# EAGLE design BLDC_Motor_Controller_IR2184 (EAGLE 9.1.3)
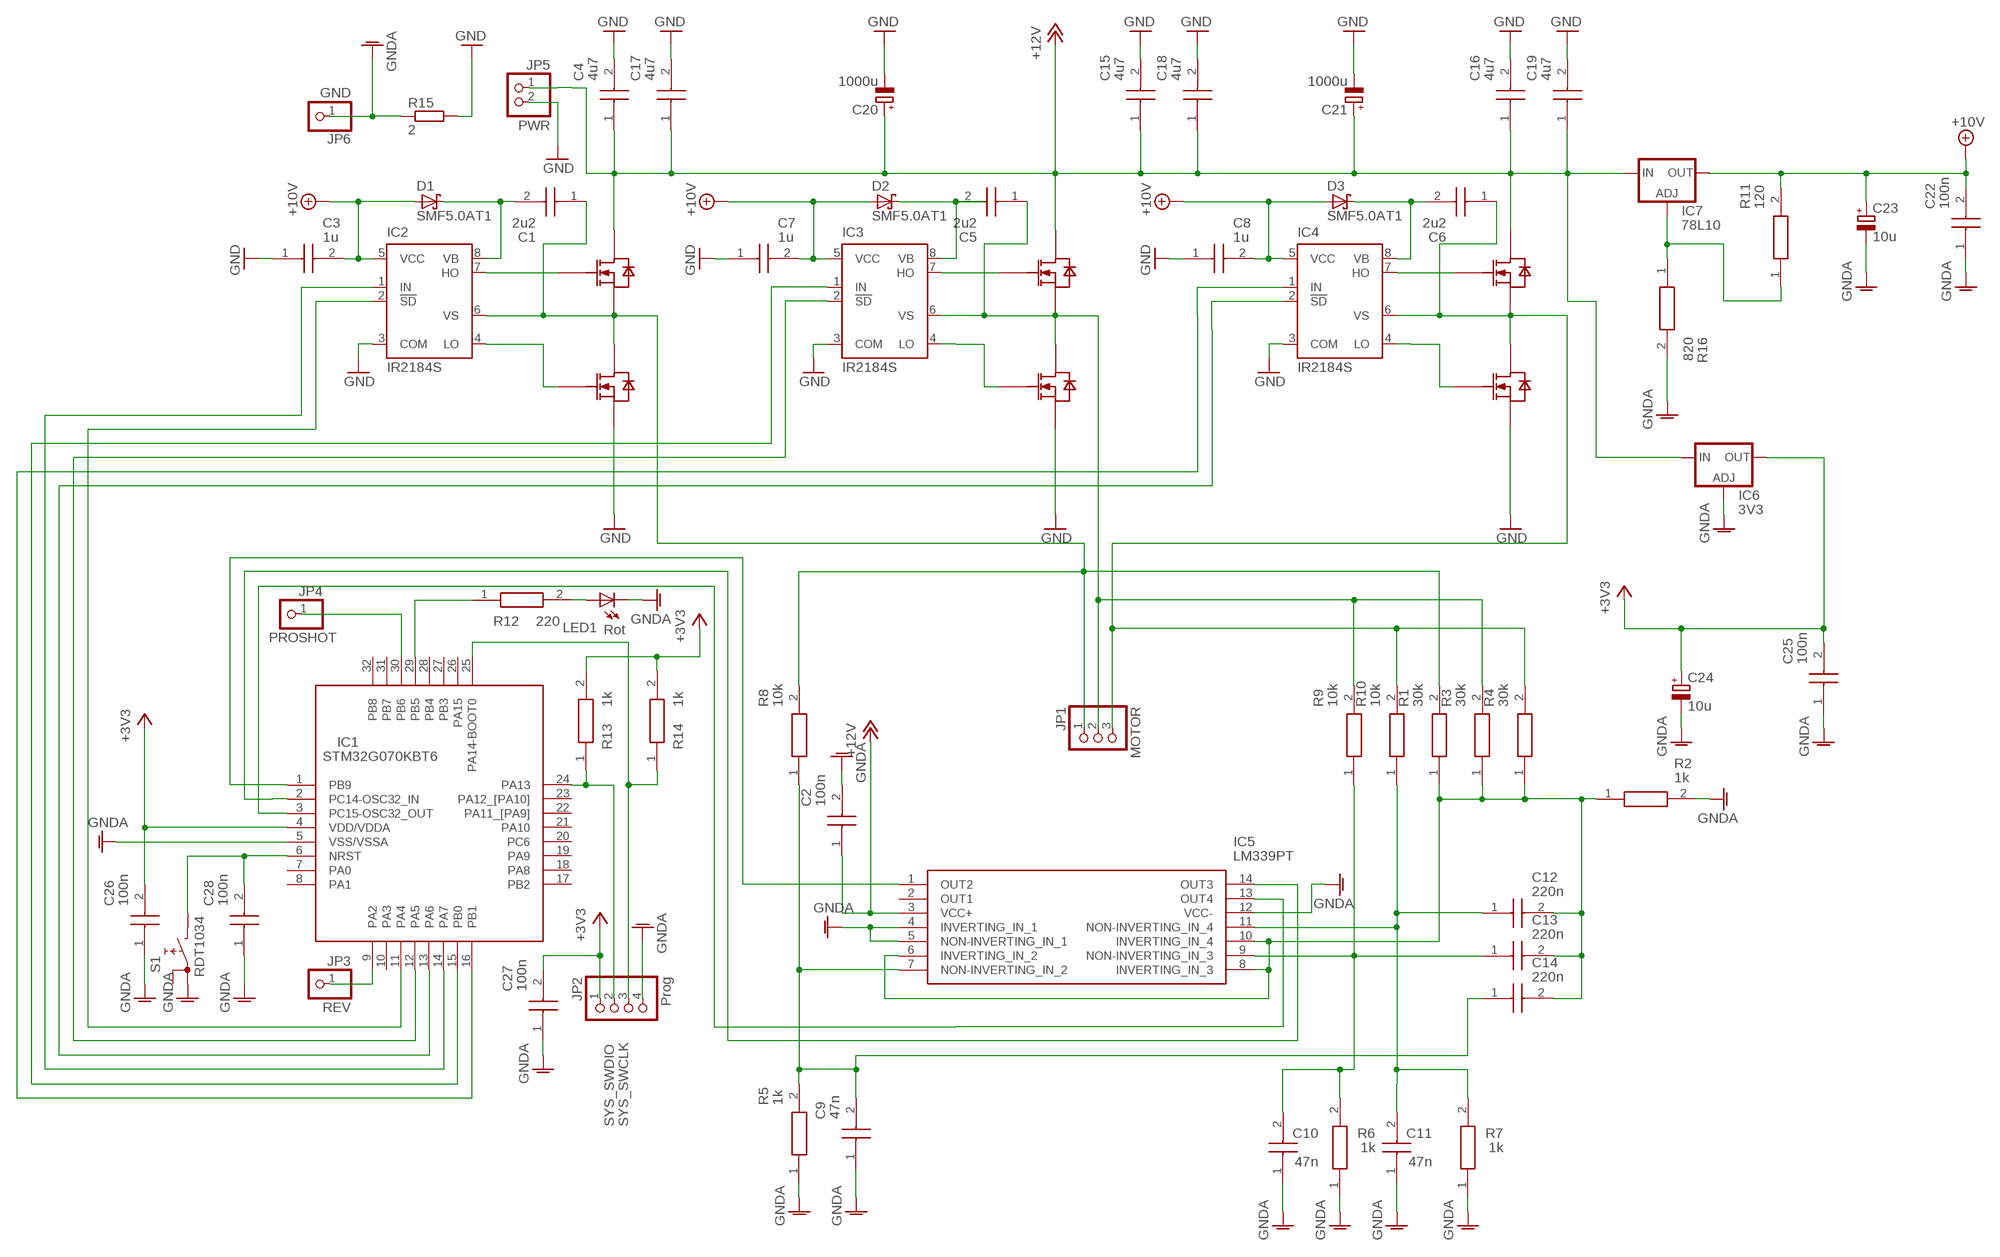
[diagram p0: schematic, sheet 1]

## Parts
C1  2u2  CL21B225KAFNNNE  [CAPC2012X135N]
C2  100n  C2012X7T2E104M125AE  [CAPC2012X145N]
C3  1u  GRM31CC72A475KE11K  [GRM31X]
C4  4u7  GRM31CC72A475KE11K  [GRM31X]
C5  2u2  CL21B225KAFNNNE  [CAPC2012X135N]
C6  2u2  CL21B225KAFNNNE  [CAPC2012X135N]
C7  1u  GRM31CC72A475KE11K  [GRM31X]
C8  1u  GRM31CC72A475KE11K  [GRM31X]
C9  47n  C2012X7T2E104M125AE  [CAPC2012X145N]
C10  47n  C2012X7T2E104M125AE  [CAPC2012X145N]
C11  47n  C2012X7T2E104M125AE  [CAPC2012X145N]
C12  220n  C2012X7T2E104M125AE  [CAPC2012X145N]
C13  220n  C2012X7T2E104M125AE  [CAPC2012X145N]
C14  220n  C2012X7T2E104M125AE  [CAPC2012X145N]
C15  4u7  GRM31CC72A475KE11K  [GRM31X]
C16  4u7  GRM31CC72A475KE11K  [GRM31X]
C17  4u7  GRM31CC72A475KE11K  [GRM31X]
C18  4u7  GRM31CC72A475KE11K  [GRM31X]
C19  4u7  GRM31CC72A475KE11K  [GRM31X]
C20  1000u  CPOL-EU150CLZ-0810  [150CLZ-0810]
C21  1000u  CPOL-EU150CLZ-0810  [150CLZ-0810]
C22  100n  C2012X7T2E104M125AE  [CAPC2012X145N]
C23  10u  CPOL-EUSMCC  [SMC_C]
C24  10u  CPOL-EUSMCC  [SMC_C]
C25  100n  C2012X7T2E104M125AE  [CAPC2012X145N]
C26  100n  C2012X7T2E104M125AE  [CAPC2012X145N]
C27  100n  C2012X7T2E104M125AE  [CAPC2012X145N]
C28  100n  C2012X7T2E104M125AE  [CAPC2012X145N]
D1  SMF5.0AT1  [SOD123FL]
D2  SMF5.0AT1  [SOD123FL]
D3  SMF5.0AT1  [SOD123FL]
IC1  STM32G070KBT6  [QFP80P900X900X160-32N]
IC2  IR2184S  [SO08]
IC3  IR2184S  [SO08]
IC4  IR2184S  [SO08]
IC5  LM339PT  [SOP65P640X120-14N]
IC6  3V3  LD117AS33TR  [SOT223]
IC7  78L10  LD117ASTR  [SOT223]
JP1  MOTOR  PINHD-1X3  [1X03]
JP2  Prog  PINHD-1X4  [1X04]
JP3  REV  PINHD-1X1  [1X01]
JP4  PROSHOT  PINHD-1X1  [1X01]
JP5  PWR  PINHD-1X2  [1X02]
JP6  GND  PINHD-1X1  [1X01]
LED1  Rot  LEDSML0805  [SML0805]
Q1  IRFR1205TRPBF  [TO229P991X239-3_4N]
Q2  IRFR1205TRPBF  [TO229P991X239-3_4N]
Q3  IRFR1205TRPBF  [TO229P991X239-3_4N]
Q4  IRFR1205TRPBF  [TO229P991X239-3_4N]
Q5  IRFR1205TRPBF  [TO229P991X239-3_4N]
Q6  IRFR1205TRPBF  [TO229P991X239-3_4N]
R1  30k  ERJ-UP6F1180V  [ERJUP6]
R2  1k  ERJ-UP6F1180V  [ERJUP6]
R3  30k  ERJ-UP6F1180V  [ERJUP6]
R4  30k  ERJ-UP6F1180V  [ERJUP6]
R5  1k  ERJ-UP6F1180V  [ERJUP6]
R6  1k  ERJ-UP6F1180V  [ERJUP6]
R7  1k  ERJ-UP6F1180V  [ERJUP6]
R8  10k  ERJ-UP6F1180V  [ERJUP6]
R9  10k  ERJ-UP6F1180V  [ERJUP6]
R10  10k  ERJ-UP6F1180V  [ERJUP6]
R11  120  ERJ-UP6F1180V  [ERJUP6]
R12  220  ERJ-UP6F1180V  [ERJUP6]
R13  1k  ERJ-UP6F1180V  [ERJUP6]
R14  1k  ERJ-UP6F1180V  [ERJUP6]
R15  2  R-EU_R2012  [R2012]
R16  820  ERJ-UP6F1180V  [ERJUP6]
S1  RDT1034  [RDT1034]

## Nets
+3V3: C24.+ C25.2 C26.2 C27.2 IC1.4(VDD/VDDA) IC6.4(OUT) JP2.1 R13.2 R14.2
+10V: C3.2 C7.2 C8.2 C22.2 C23.+ D1.A D2.A D3.A IC2.5(VCC) IC3.5(VCC) IC4.5(VCC) IC7.4(OUT) R11.2
+12V: C2.1 C4.1 C15.1 C16.1 C17.1 C18.1 C19.1 C20.+ C21.+ IC5.3(VCC+) IC6.3(IN) IC7.3(IN) JP5.1 Q1.4(DRAIN) Q3.4(DRAIN) Q5.4(DRAIN)
BEMF_U: C9.2 C14.1 IC5.7(NON-INVERTING_IN_2) R5.2 R8.1
BEMF_V: C10.2 C13.1 IC5.9(NON-INVERTING_IN_3) R6.2 R9.1
BEMFGND: C12.2 C13.2 C14.2 IC5.6(INVERTING_IN_2) IC5.8(INVERTING_IN_3) IC5.10(INVERTING_IN_4) R1.1 R2.1 R3.1 R4.1
BEMV_W: C11.2 C12.1 IC5.11(NON-INVERTING_IN_4) R7.2 R10.1
GND: C3.1 C4.2 C7.1 C8.1 C15.2 C16.2 C17.2 C18.2 C19.2 C20.- C21.- IC2.3(COM) IC3.3(COM) IC4.3(COM) JP5.2 Q2.3(SOURCE) Q4.3(SOURCE) Q6.3(SOURCE) R15.2
GNDA: C2.2 C9.1 C10.1 C11.1 C22.1 C23.- C24.- C25.1 C26.1 C27.1 C28.1 IC1.5(VSS/VSSA) IC5.4(INVERTING_IN_1) IC5.5(NON-INVERTING_IN_1) IC5.12(VCC-) IC6.1(ADJ) JP2.4 JP6.1 LED1.C R2.2 R5.1 R6.1 R7.1 R15.1 R16.2 S1.A1
IN_U: IC1.14(PA7) IC2.1(IN)
IN_V: IC1.15(PB0) IC3.1(IN)
IN_W: IC1.16(PB1) IC4.1(IN)
INT_U: IC1.1(PB9) IC5.1(OUT2)
INT_V: IC1.2(PC14-OSC32_IN) IC5.14(OUT3)
INT_W: IC1.3(PC15-OSC32_OUT) IC5.13(OUT4)
N$1: C5.2 D2.C IC3.8(VB)
N$2: IC3.7(HO) Q3.1(GATE)
N$3: LED1.A R12.2
N$4: IC4.7(HO) Q5.1(GATE)
N$5: C6.2 D3.C IC4.8(VB)
N$6: IC3.4(LO) Q4.1(GATE)
N$7: IC2.7(HO) Q1.1(GATE)
N$8: IC2.4(LO) Q2.1(GATE)
N$9: IC7.1(ADJ) R11.1 R16.1
N$10: IC4.4(LO) Q6.1(GATE)
N$11: C1.2 D1.C IC2.8(VB)
N$14: IC1.29(PB5) R12.1
N$18: IC1.9(PA2) JP3.1
N$26: C28.2 IC1.6(NRST) S1.B
N$31: IC1.30(PB6) JP4.1
SD_U: IC1.11(PA4) IC2.2(!SD)
SD_V: IC1.12(PA5) IC3.2(!SD)
SD_W: IC1.13(PA6) IC4.2(!SD)
SYS_SWCLK: IC1.25(PA14-BOOT0) JP2.3 R14.1
SYS_SWDIO: IC1.24(PA13) JP2.2 R13.1
U: C1.1 IC2.6(VS) JP1.1 Q1.3(SOURCE) Q2.4(DRAIN) R1.2 R8.2
V: C5.1 IC3.6(VS) JP1.2 Q3.3(SOURCE) Q4.4(DRAIN) R3.2 R9.2
W: C6.1 IC4.6(VS) JP1.3 Q5.3(SOURCE) Q6.4(DRAIN) R4.2 R10.2
Unconnected: IC1.7(PA0) IC1.8(PA1) IC1.10(PA3) IC1.17(PB2) IC1.18(PA8) IC1.19(PA9) IC1.20(PC6) IC1.21(PA10) IC1.22(PA11_[PA9]) IC1.23(PA12_[PA10]) IC1.26(PA15) IC1.27(PB3) IC1.28(PB4) IC1.31(PB7) IC1.32(PB8) IC5.2(OUT1) S1.A

## Library data of the parts
C1 C5 C6 = SamacSys_Parts:CL21B225KAFNNNE: Multilayer Ceramic Capacitors MLCC - SMD/SMT Source: Datasheet <https://datasheet.datasheetarchive.com/originals/distributors/Datasheets_SAMA/ca4cf5b380bdfbb19a7117d5cd03bc0d.pdf>; DESCRIPTION: Multilayer Ceramic Capacitors MLCC - SMD/SMT; HEIGHT: 1.35mm; MANUFACTURER_NAME: SAMSUNG; MANUFACTURER_PART_NUMBER: CL21B225KAFNNNE; MOUSER_PART_NUMBER: 187-CL21B225KAFNNNE; MOUSER_PRICE-STOCK: https://www.mouser.co.uk/ProductDetail/Samsung-Electro-Mechanics/CL21B225KAFNNNE?qs=PPfjzIQ%252BipRYUTZ31NBO%252Bg%3D%3D
C2 C9-C14 C22 C25-C28 = SamacSys_Parts:C2012X7T2E104M125AE: TDK 0805 C 100nF Ceramic Multilayer Capacitor, 250 V dc, +125C, X7T Dielectric, +/-20% Source: Datasheet <https://product.tdk.com/info/en/catalog/datasheets/mlcc_commercial_midvoltage_en.pdf>; DESCRIPTION: TDK 0805 C 100nF Ceramic Multilayer Capacitor, 250 V dc, +125C, X7T Dielectric, +/-20%; HEIGHT: 1.45mm; MANUFACTURER_NAME: TDK; MANUFACTURER_PART_NUMBER: C2012X7T2E104M125AE; MOUSER_PART_NUMBER: 810-C2012X7T2E104MST; MOUSER_PRICE-STOCK: https://www.mouser.co.uk/ProductDetail/TDK/C2012X7T2E104M125AE?qs=LcTL%2F5vFEzEBl%252BBNoexy6w%3D%3D
C3 C7 C8 = SamacSys_Parts:GRM31CC72A475KE11K: MLCC, 1206 Source: Datasheet <https://search.murata.co.jp/Ceramy/image/img/A01X/G101/ENG/GRM31CC72A475KE11-01A.pdf>; DESCRIPTION: MLCC, 1206; HEIGHT: 1.15mm; MANUFACTURER_NAME: Murata Electronics; MANUFACTURER_PART_NUMBER: GRM31CC72A475KE11K; MOUSER_PART_NUMBER: 81-GRM31CC72A475KE1K; MOUSER_PRICE-STOCK: https://www.mouser.co.uk/ProductDetail/Murata-Electronics/GRM31CC72A475KE11K?qs=d0WKAl%252BL4KaOKvbzjRPpKw%3D%3D
C4 C15-C19 = GRM31CC72A475KE11K:GRM31CC72A475KE11K: MLCC, 1206 Source: Datasheet <https://search.murata.co.jp/Ceramy/image/img/A01X/G101/ENG/GRM31CC72A475KE11-01A.pdf>; DESCRIPTION: MLCC, 1206; HEIGHT: 1.15mm; MANUFACTURER_NAME: Murata Electronics; MANUFACTURER_PART_NUMBER: GRM31CC72A475KE11K; MOUSER_PART_NUMBER: 81-GRM31CC72A475KE1K; MOUSER_PRICE-STOCK: https://www.mouser.co.uk/ProductDetail/Murata-Electronics/GRM31CC72A475KE11K?qs=d0WKAl%252BL4KaOKvbzjRPpKw%3D%3D
C20 C21 C23 C24 = rcl:CPOL-EU: POLARIZED CAPACITOR, European symbol; SPICEPREFIX: C
D1-D3 = diode:SMF5.0AT1: 200 W Transient Voltage Suppressor Source: Data sheet <http://www.onsemi.com/pub_link/Collateral/SMF5.0AT1-D.PDF>
IC1 = SamacSys_Parts:STM32G070KBT6: 32-bit Microcontrollers - MCU Arm Cortex -M0+ 32-bit MCU, 128 KB Flash, 36 KB RAM, 4x USART, timers, ADC, comm. I/Fs, 2.0-3.6V Source: Datasheet; DESCRIPTION: 32-bit Microcontrollers - MCU Arm Cortex -M0+ 32-bit MCU, 128 KB Flash, 36 KB RAM, 4x USART, timers, ADC, comm. I/Fs, 2.0-3.6V; HEIGHT: 1.6mm; MANUFACTURER_NAME: STMicroelectronics; MANUFACTURER_PART_NUMBER: STM32G070KBT6; MOUSER_PART_NUMBER: 511-STM32G070KBT6; MOUSER_PRICE-STOCK: https://www.mouser.co.uk/ProductDetail/STMicroelectronics/STM32G070KBT6?qs=l7cgNqFNU1hmGcXjKEot4A%3D%3D
IC2-IC4 = IR2184:IR2184: HALF-BRIDGE DRIVER www.irf.com Data Sheet No. PD60174 revG Features *Floating channel designed for bootstrap operation Fully operational to +600V *Tolerant to negative transient voltage dV/dt immune * Gate drive supply range from 10 to 20V * Undervoltage lockout for both channels * 3.3V and 5V input logic compatible * Matched propagation delay for both channels * Logic and power ground +/- 5V offset. * Lower di/dt gate driver for better noise immunity * Output source/sink current capability 1.4A/1.8A * Also available LEAD-FREE (PbF); MF: INTERNATIONAL RECTIFIER(IR); MPN: IR2184
IC5 = SamacSys_Parts:LM339PT: LM339PT,Voltage comparator,quad,TSSOP14 STMicroelectronics LM339PT Quad Comparator, CMOS/TTL O/P, 1.3us 2 36 V 14-Pin TSSOP Source: Datasheet <http://www.st.com/web/en/resource/technical/document/datasheet/CD00000460.pdf>; DESCRIPTION: LM339PT,Voltage comparator,quad,TSSOP14 STMicroelectronics LM339PT Quad Comparator, CMOS/TTL O/P, 1.3us 2 36 V 14-Pin TSSOP; HEIGHT: 1.2mm; MANUFACTURER_NAME: STMicroelectronics; MANUFACTURER_PART_NUMBER: LM339PT; MOUSER_PART_NUMBER: 511-LM339P; MOUSER_PRICE-STOCK: https://www.mouser.co.uk/ProductDetail/STMicroelectronics/LM339PT?qs=qY7WzS0PiaebXCzOp7NP%2FA%3D%3D
IC6 IC7 = v-reg:LD117A?*: Low drop fixed and adjustable positive voltage regulators 1 A Source: http://www.st.com/stonline/products/literature/ds/7194/ld1117axx.pdf
JP1 = pinhead:PINHD-1X3: PIN HEADER
JP2 = pinhead:PINHD-1X4: PIN HEADER
JP3 JP4 JP6 = pinhead:PINHD-1X1: PIN HEADER
JP5 = pinhead:PINHD-1X2: PIN HEADER
LED1 = led:LED: LED OSRAM: - CHIPLED LG R971, LG N971, LY N971, LG Q971, LY Q971, LO R971, LY R971 LH N974, LH R974 LS Q976, LO Q976, LY Q976 LO Q996 - Hyper CHIPLED LW Q18S LB Q993, LB Q99A, LB R99A - SideLED LS A670, LO A670, LY A670, LG A670, LP A670 LB A673, LV A673, LT A673, LW A673 LH A674 LY A675 LS A676, LA A676, LO A676, LY A676, LW A676 LS A679, LY A679, LG A679 - Hyper Micro SIDELED® LS Y876, LA Y876, LO Y876, LY Y876 LT Y87S - SmartLED LW L88C, LW L88S LB L89C, LB L89S, LG L890 LS L89K, LO L89K, LY L89K LS L896, LA L896, LO L896, LY L896 - TOPLED LS T670, LO T670, LY T670, LG T670, LP T670 LSG T670, LSP T670, LSY T670, LOP T670, LYG T670 LG T671, LOG T671, LSG T671 LB T673, LV T673, LT T673, LW T673 LH T674 LS T676, LA T676, LO T676, LY T676, LB T676, LH T676, LSB T676, LW T676 LB T67C, LV T67C, LT T67C, LS T67K, LO T67K, LY T67K, LW E67C LS E67B, LA E67B, LO E67B, LY E67B, LB E67C, LV E67C, LT E67C LW T67C LS T679, LY T679, LG T679 LS T770, LO T770, LY T770, LG T770, LP T770 LB T773, LV T773, LT T773, LW T773 LH T774 LS E675, LA E675, LY E675, LS T675 LS T776, LA T776, LO T776, LY T776, LB T776 LHGB T686 LT T68C, LB T68C - Hyper Mini TOPLED® LB M676 - Mini TOPLED Santana® LG M470 LS M47K, LO M47K, LY M47K Source: http://www.osram.convergy.de LUXEON: - LUMILED® LXK2-PW12-R00, LXK2-PW12-S00, LXK2-PW14-U00, LXK2-PW14-V00 LXK2-PM12-R00, LXK2-PM12-S00, LXK2-PM14-U00 LXK2-PE12-Q00, LXK2-PE12-R00, LXK2-PE12-S00, LXK2-PE14-T00, LXK2-PE14-U00 LXK2-PB12-K00, LXK2-PB12-L00, LXK2-PB12-M00, LXK2-PB14-N00, LXK2-PB14-P00, LXK2-PB14-Q00 LXK2-PR12-L00, LXK2-PR12-M00, LXK2-PR14-Q00, LXK2-PR14-R00 LXK2-PD12-Q00, LXK2-PD12-R00, LXK2-PD12-S00 LXK2-PH12-R00, LXK2-PH12-S00 LXK2-PL12-P00, LXK2-PL12-Q00, LXK2-PL12-R00 Source: www.luxeon.com KINGBRIGHT: KA-3528ASYC Source: www.kingbright.com
Q1-Q6 = IRFR1205TRPBF:IRFR1205TRPBF: IRFR1205TRPBF HEXFET Power MOSFET VDSS=-100V, ID=-13A TO229P991X239-3_4N
R1-R14 R16 = SamacSys_Parts:ERJ-UP6F1180V: Anti-Sulfurated Thick Film Chip Resistors/ Anti-Surge Type, Power Rating (W): 0.5, Chip Size (LxW(EIA)) (mm): 2.0 x 1.25 (EIA:0805), Resistance Values (?): 118, Resistance Tolerance (%): 1, T.C.R (?102/K): ?100 Source: Datasheet <https://industrial.panasonic.com/cdbs/www-data/pdf/RDP0000/AOA0000C337.pdf>; DESCRIPTION: Anti-Sulfurated Thick Film Chip Resistors/ Anti-Surge Type, Power Rating (W): 0.5, Chip Size (LxW(EIA)) (mm): 2.0 x 1.25 (EIA:0805), Resistance Values (?): 118, Resistance Tolerance (%): 1, T.C.R (?102/K): ?100; HEIGHT: 0.7mm; MANUFACTURER_NAME: Panasonic; MANUFACTURER_PART_NUMBER: ERJ-UP6F1180V
R15 = rcl:R-EU_: RESISTOR, European symbol; SPICEPREFIX: R
S1 = switch:RDT1034: PUSH SWITCH www.radiohm.com

## Board
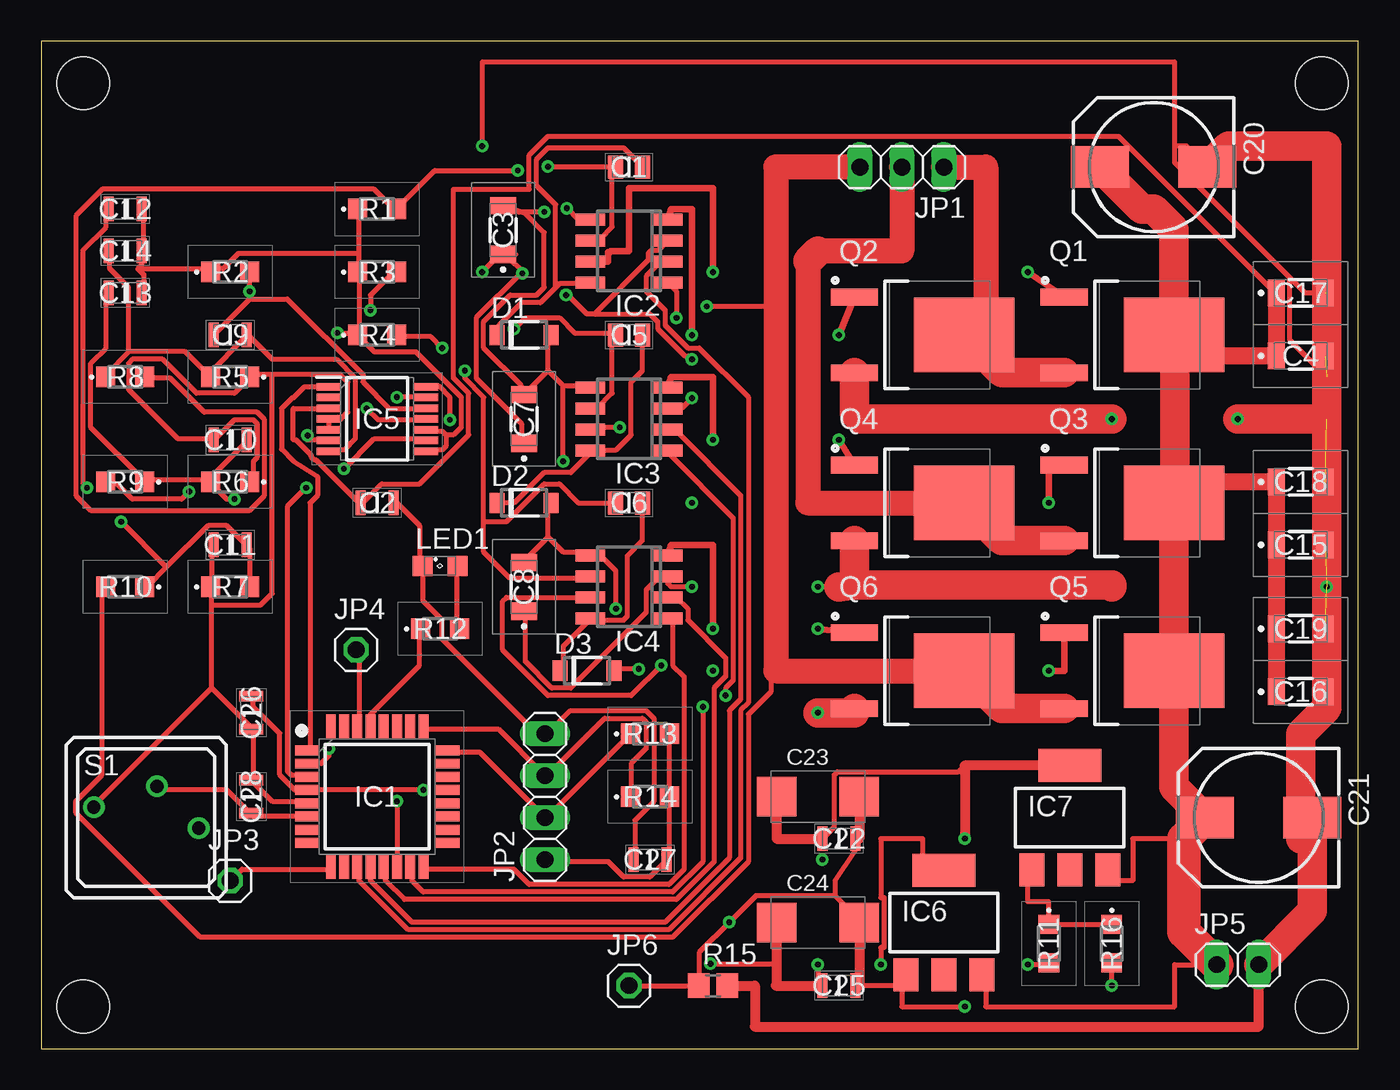
[diagram p1: board, top side]
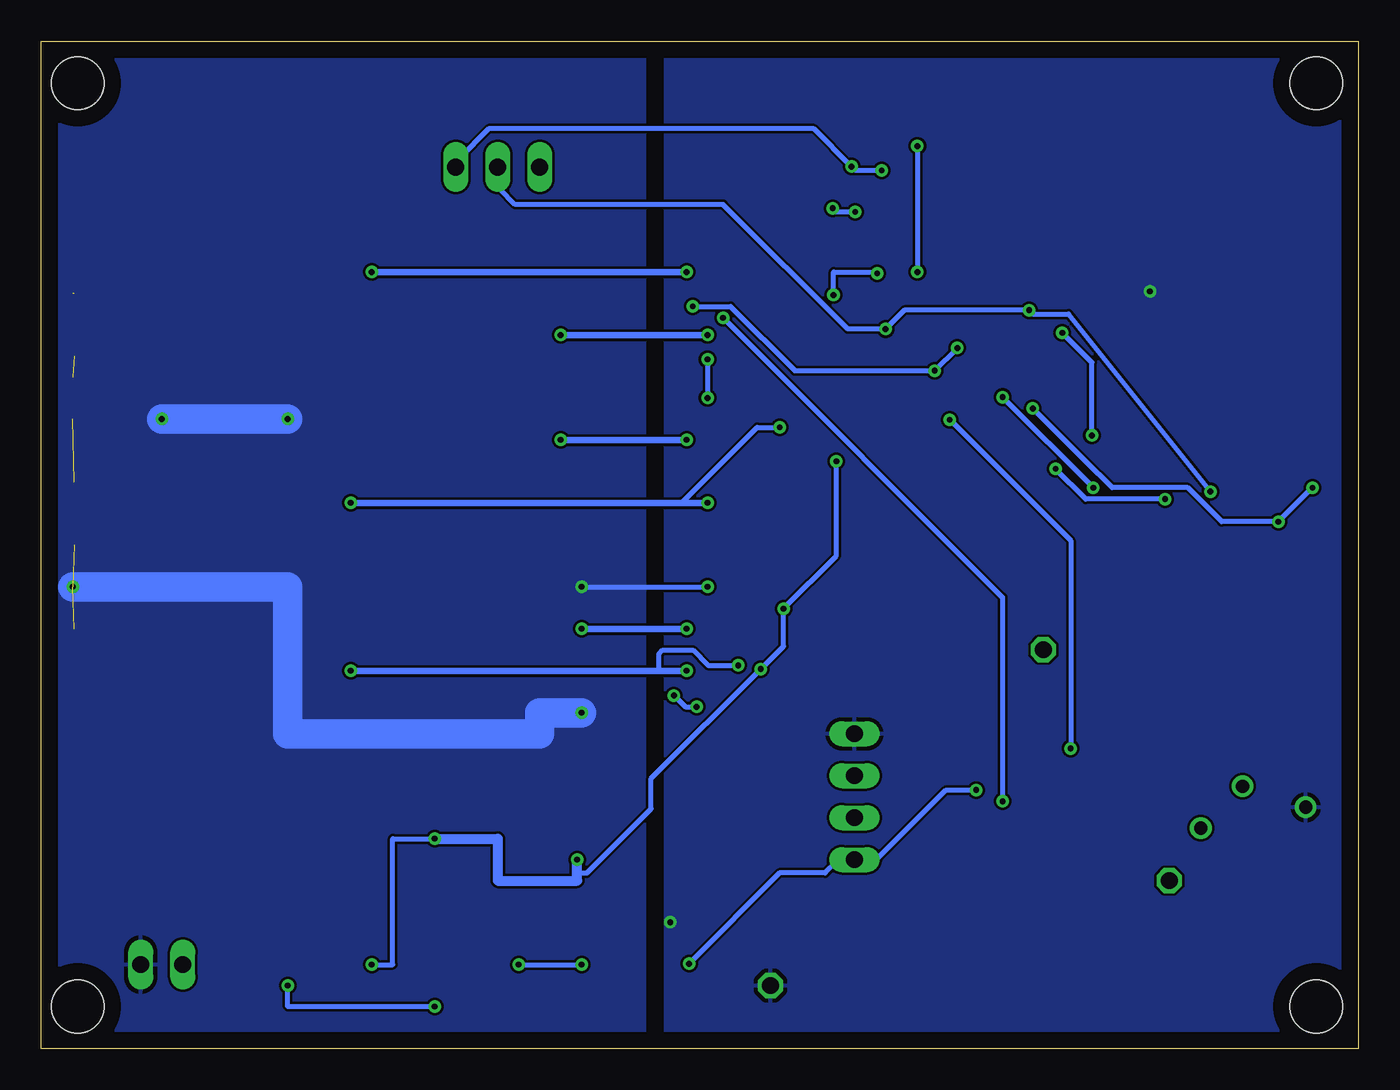
[diagram p2: board, bottom side, seen from below]

Size 79.68 x 60.95 mm. Coordinates in mm from the lower left corner, seen from the top.
Outline: 0,0 79.68,0 79.68,60.95 0,60.95 0,0
Copper layers (1*16): Top 0.035mm / dielectric 1.5mm / Bottom 0.035mm
Design rules "default *": minimum track width 12mil, minimum drill 0.35mm, track to track 6mil, track to pad 6mil, pad to pad 6mil, via to via 6mil, smd to smd 6mil, copper to edge 40mil, drill to drill 6mil, minimum pad ring 10mil, minimum via ring 8mil, stop-mask expansion 4mil, vias tented up to drill 0mil, thermal gap 10mil
Holes 3.17 mm at 2.54,58.42 2.54,2.54 77.47,2.54 77.47,58.42

### Footprints (pad centres in the part's own frame; a part is rotated, then mirrored left to right if it is on the bottom)
CAPC2012X135N = smd 0.91 x 1.39: 1 -0.82,0; 2 0.82,0
CAPC2012X145N = smd 0.62 x 1.47: 1 -1,0; 2 1,0
GRM31X = smd 1.05 x 1.6: 1 -1.475,0; 2 1.475,0
150CLZ-0810 = smd 3.5 x 2.5: + 3.25,0; - -3.25,0
SMC_C = smd 2.4 x 2.4: + -2.5,0; - 2.5,0
SOD123FL = smd 0.91 x 1.22: A 1.625,0; C -1.625,0
QFP80P900X900X160-32N = smd 1.475 x 0.6: 1 -4.238,2.8; 2 -4.238,2; 3 -4.238,1.2; 4 -4.238,0.4; 5 -4.238,-0.4; 6 -4.238,-1.2; 7 -4.238,-2; 8 -4.238,-2.8; 17 4.238,-2.8; 18 4.238,-2; 19 4.238,-1.2; 20 4.238,-0.4; 21 4.238,0.4; 22 4.238,1.2; 23 4.238,2; 24 4.238,2.8 | smd 0.6 x 1.475: 9 -2.8,-4.238; 10 -2,-4.238; 11 -1.2,-4.238; 12 -0.4,-4.238; 13 0.4,-4.238; 14 1.2,-4.238; 15 2,-4.238; 16 2.8,-4.238; 25 2.8,4.238; 26 2,4.238; 27 1.2,4.238; 28 0.4,4.238; 29 -0.4,4.238; 30 -1.2,4.238; 31 -2,4.238; 32 -2.8,4.238
SO08 = smd 0.72 x 1.78: 1 -1.905,-2.35; 2 -0.635,-2.35; 3 0.635,-2.35; 4 1.905,-2.35; 5 1.905,2.35; 6 0.635,2.35; 7 -0.635,2.35; 8 -1.905,2.35
SOP65P640X120-14N = smd 1.475 x 0.45: 1 -2.938,1.95; 2 -2.938,1.3; 3 -2.938,0.65; 4 -2.938,0; 5 -2.938,-0.65; 6 -2.938,-1.3; 7 -2.938,-1.95; 8 2.938,-1.95; 9 2.938,-1.3; 10 2.938,-0.65; 11 2.938,0; 12 2.938,0.65; 13 2.938,1.3; 14 2.938,1.95
SOT223 = smd 1.5 x 2: 1 -2.3,-3.15; 2 0,-3.15; 3 2.3,-3.15 | smd 3.8 x 2: 4 0,3.15
1X03 = drill 1.016 long: 1 -2.54,0; 2 0,0; 3 2.54,0
1X04 = drill 1.016 long: 1 -3.81,0; 2 -1.27,0; 3 1.27,0; 4 3.81,0
1X01 = drill 1.016 octagon: 1 0,0
1X02 = drill 1.016 long: 1 -1.27,0; 2 1.27,0
SML0805 = smd 1.2 x 1.2: A 1.05,0; C -1.05,0
TO229P991X239-3_4N = smd 2.85 x 1: 1 -4.15,2.29; 3 -4.15,-2.29 | smd 6.1 x 4.5: 4 2.5,0
ERJUP6 = smd 1.15 x 1.25: 1 -1.175,0; 2 1.175,0
R2012 = smd 1.3 x 1.5: 1 -0.85,0; 2 0.85,0
RDT1034 = drill 0.8: A 3.175,-0.635; A1 -3.175,0.635; B 0.65,1.9

### Placement (x,y rotation side)
C1  35.56,53.34 0 top
C2  20.32,33.02 0 top
C3  27.94,49.53 90 top
C4  76.2,41.91 0 top
C5  35.56,43.18 0 top
C6  35.56,33.02 0 top
C7  29.21,38.1 90 top
C8  29.21,27.94 90 top
C9  11.43,43.18 0 top
C10  11.43,36.83 0 top
C11  11.43,30.48 0 top
C12  5.08,50.8 0 top
C13  5.08,45.72 0 top
C14  5.08,48.26 0 top
C15  76.2,30.48 0 top
C16  76.2,21.59 0 top
C17  76.2,45.72 0 top
C18  76.2,34.29 0 top
C19  76.2,25.4 0 top
C20  67.31,53.34 180 top
C21  73.66,13.97 180 top
C22  48.26,12.7 180 top
C23  46.99,15.24 0 top
C24  46.99,7.62 0 top
C25  48.26,3.81 180 top
C26  12.7,20.32 90 top
C27  36.83,11.43 0 top
C28  12.7,15.24 270 top
D1  29.21,43.18 0 top
D2  29.21,33.02 0 top
D3  33.02,22.86 0 top
IC1  20.32,15.24 0 top
IC2  35.56,48.26 90 top
IC3  35.56,38.1 90 top
IC4  35.56,27.94 90 top
IC5  20.32,38.1 0 top
IC6  54.61,7.62 0 top
IC7  62.23,13.97 0 top
JP1  52.07,53.34 180 top
JP2  30.48,15.24 90 top
JP3  11.43,10.16 0 top
JP4  19.05,24.13 0 top
JP5  72.39,5.08 0 top
JP6  35.56,3.81 0 top
LED1  24.13,29.21 0 top
Q1  66.04,43.18 0 top
Q2  53.34,43.18 0 top
Q3  66.04,33.02 0 top
Q4  53.34,33.02 0 top
Q5  66.04,22.86 0 top
Q6  53.34,22.86 0 top
R1  20.32,50.8 0 top
R2  11.43,46.99 0 top
R3  20.32,46.99 0 top
R4  20.32,43.18 0 top
R5  11.43,40.64 180 top
R6  11.43,34.29 180 top
R7  11.43,27.94 0 top
R8  5.08,40.64 0 top
R9  5.08,34.29 180 top
R10  5.08,27.94 180 top
R11  60.96,6.35 270 top
R12  24.13,25.4 0 top
R13  36.83,19.05 0 top
R14  36.83,15.24 0 top
R15  40.64,3.81 0 top
R16  64.77,6.35 270 top
S1  6.35,13.97 0 top

### Tracks (layer width: path | path; a pad name or v marks a point on that pad's centre or on a via)
+3V3  (via drill 0.35)
  Top 0.305: C26.2 12.83,21.13 12.83,20.68 14.43,19.07 14.43,16.56 15.34,15.65 16.03,15.65 IC1.4 16.26,15.65 v23.11,15.65 | R13.2 37.97,18.85 37.97,15.42 R14.2 37.97,15.19 37.97,11.53 C27.2 37.74,11.3 36.83,10.39 35.23,10.39 34.31,11.3 30.66,11.3 JP2.1 | v40.49,5.13 44.37,5.13 44.49,5.13 | IC6.4 53.34,10.77 53.34,12.7 50.8,12.7 50.8,9.12 50.99,9.12 50.99,6.12 50.8,6.12 v50.8,5.08 | v46.99,5.08 46.99,3.81
  Top 0.61: C24.+ 44.49,5.13 44.49,3.81 44.45,3.81 46.99,3.81 | 46.99,3.81 C25.2 46.99,3.81
  Bottom 0.305: v23.11,15.65 24.94,15.65 29.06,11.53 30.43,11.53 JP2.1 30.66,11.3 31.57,11.3 32.26,10.62 35,10.62 v40.49,5.13 | v50.8,5.08 v46.99,5.08
+10V  (via drill 0.35)
  Top 0.305: 30.66,41.02 30.66,43.08 D1.A | 30.66,41.02 29.29,39.65 C7.2 29.06,39.65 29.06,40.11 26.77,42.39 26.77,43.99 28.37,45.59 29.97,45.59 30.43,46.05 30.43,49.38 29.29,50.52 C3.2 28.95,50.62 v30.43,50.62 | 31.57,40.11 33.17,40.11 IC3.5 | 30.66,41.02 31.57,40.11 | IC2.5 32.49,50.17 v31.8,50.85 | 30.66,30.96 30.66,33.02 D2.A | 30.66,30.96 29.29,29.59 C8.2 | 30.66,30.96 31.57,30.05 33.17,30.05 IC4.5 33.4,29.82 33.86,29.82 34.77,28.9 v34.77,26.62 | v36.14,22.96 34.77,22.96 D3.A | v31.57,35.53 31.57,40.11 | R11.2 60.96,5.08 v59.69,5.08 | C22.2 47.99,13.43 47.99,16.57 48.16,16.75 55.51,16.75 55.88,17.12
  Top 0.61: C23.+ 44.49,12.7 C22.2 | IC7.4 55.88,17.12 v55.88,12.7
  Bottom 0.305: v31.8,50.85 31.57,50.62 v30.43,50.62 | 47.26,10.62 46.66,10.62 42.77,14.5 42.77,16.33 v36.14,22.96 34.77,24.33 v34.77,26.62 31.57,29.82 v31.57,35.53 | v59.69,5.08 58.42,5.08 58.42,12.7 v55.88,12.7
  Bottom 0.61: v55.88,12.7 52.07,12.7 52.07,10.16 47.26,10.16 47.26,10.62 v47.26,11.43
+12V
  Top 0.305: C19.1 74.78,25.48 74.72,25.48 | IC5.3 17.17,38.73 15.24,38.73 15.24,36.83 15.42,36.83 16.34,35.91 16.34,35.8 16.52,35.62 16.63,35.62 19.23,33.02 C2.1 19.46,33.02 20.6,34.16 22.88,34.16 25.86,37.14 25.86,39.65 24.94,40.56 24.94,51.99 29.52,51.99 29.52,54.05 30.66,55.19 65.18,55.19 74.55,45.82 C17.1 | 69.14,12.7 66.04,12.7 66.04,10.16 64.85,10.16 64.34,10.66 | JP5.1 68.58,5.08 68.58,2.54 57.15,2.54 57.15,4.47 IC6.3
  Top 0.61: 64.34,10.66 IC7.3
  Top 1.016: C17.1 C4.1 68.58,41.91 | C16.1 C19.1 74.72,25.48 C15.1 C18.1 69.81,34.29 Q3.4
  Top 1.778: C20.+ 66.6,50.8 67.31,50.8 68.54,49.57 Q1.4 68.58,43.14 68.58,41.91 68.58,32.98 Q3.4 Q5.4 68.54,15.84 C21.+
  Top 2.032: JP5.1 69.14,7.06 69.14,12.7 C21.+
BEMF_U
  Top 0.305: 5.28,42.16 3.91,40.79 R8.1 | 5.28,42.16 8.71,42.16 10.08,40.79 | 10.08,40.79 R5.2 10.08,40.79 | 5.28,42.16 5.28,46.05 4.14,47.19 4.14,48.11 C14.1 | 10.08,40.79 12.37,43.08 C9.2 12.6,43.08 13.97,41.71 17.86,41.71 19,40.56 19,36.91 18.31,36.22 17.4,36.22 IC5.7
BEMF_V  (via drill 0.35)
  Top 0.305: 10.08,34.39 6.43,34.39 R9.1 6.2,34.39 3,37.59 3,41.48 3.91,42.39 3.91,45.59 C13.1 | 10.08,34.39 R6.2 | 10.08,34.39 12.37,36.68 C10.2 | 10.08,34.39 R6.2 | v18.31,35.08 20.14,36.91 23.11,36.91 IC5.9 | v11.68,33.25 11.23,33.25 10.31,34.16 R6.2
  Bottom 0.305: v18.31,35.08 16.48,33.25 v11.68,33.25
BEMFGND  (via drill 0.35)
  Top 0.305: 5.84,47.19 10.08,47.19 R2.1 10.31,47.19 11,47.19 11.91,48.11 19.23,48.11 | 5.84,47.19 6.08,47.43 C14.2 6.2,48.34 6.2,50.62 C12.2 | 5.84,47.19 6.2,46.84 6.2,45.82 C13.2 | 24.49,37.14 24.49,36.45 24.26,36.22 23.34,36.22 IC5.8 | 24.49,37.14 24.26,37.36 23.34,37.36 IC5.10 | 19.23,43.31 19.23,46.97 R3.1 19.23,47.19 19.23,48.11 | 19.23,43.31 R4.1 19.23,43.08 20.14,42.16 22.66,42.16 25.4,39.42 25.4,37.59 24.94,37.14 24.49,37.14 | 19.23,48.11 19.23,50.62 R1.1 | IC5.6 17.35,36.83 16.06,36.83 16.06,37.05 v16.11,37.1 | v17.91,43.31 19.23,43.31
  Bottom 0.305: v16.11,37.1 16.11,41.51 v17.91,43.31
BEMV_W  (via drill 0.35)
  Top 0.305: 7.57,29.13 10.08,31.65 11.23,31.65 12.37,30.5 C11.2 12.6,30.28 12.6,27.99 R7.2 | 7.57,29.13 6.43,27.99 R10.1 | v2.77,33.93 2.54,34.16 2.54,48.34 3.91,49.71 3.91,50.62 C12.1 | 7.57,29.13 v4.83,31.88 | v19.69,38.73 20.37,38.05 23.11,38.05 IC5.11
  Bottom 0.305: v2.77,33.93 v4.83,31.88 8.25,31.88 10.31,33.93 14.88,33.93 16.51,35.56 v19.69,38.73
GND  (via drill 0.35)  (5 unrouted)
  Top 0.305: C8.1 29.29,26.39 29.29,23.42 30.89,21.82 32.03,21.82 36.6,26.39 36.6,27.76 37.29,28.45 37.74,28.45 IC4.3 37.91,28.13 38.07,27.97 39.34,27.97 v39.37,27.94 | C7.1 29.06,36.68 29.06,37.82 26.31,40.56 26.31,44.22 29.06,46.97 v29.11,46.9 29.11,47.06 C3.1 | 77.78,21.59 C16.2 | 48.26,27.94 v46.99,27.94 | 77.78,40.64 75.56,42.86 75.56,46.65 | 68.58,54.61 68.58,53.62 75.56,46.65 | 68.58,54.61 68.58,59.69 26.67,59.69 v26.67,54.61 | C3.1 27.73,48.06 v26.67,46.99 | 77.78,45.72 76.48,45.72 75.56,46.65 | C20.- 69.29,54.61 68.58,54.61 | 28.7,48.06 C3.1 | 33.46,44.45 33.02,44.45 31.75,45.72 v31.75,45.6 | IC2.3 37.3,48.29 36.89,48.29 36.71,48.11 36.71,47.7 33.46,44.45 | 33.46,44.45 36.83,44.45 37.29,43.99 37.29,43.58 38.95,41.91 39.17,41.91 | 39.17,41.91 39.37,41.91 | 39.17,41.91 v39.37,41.71 | v39.37,39.37 38.73,38.73 IC3.3
  Top 0.61: R15.2 43.18,3.81 43.18,1.32 73.66,1.32 JP5.2
  Top 1.778: C20.- 71.83,54.61 77.78,54.61 77.78,45.72 77.78,40.64 77.78,38.1 | 76.2,12.7 76.2,19.05 77.78,20.63 77.78,21.59 v77.78,27.94 77.78,38.1 | C21.- 76.91,8.33 JP5.2 | Q2.3 49.19,38.44 49.53,38.1 v64.77,38.1 | v72.39,38.1 77.78,38.1 | 49.19,28.05 48.26,27.94 | Q4.3 49.19,28.05 | Q6.3 49.19,20.32 v46.99,20.32 | 49.19,28.05 64.77,28.05 64.77,27.94
  Bottom 0.305: v46.99,27.94 v39.37,27.94 | v26.67,54.61 v26.67,46.99 | v31.75,45.6 31.75,46.99 29.2,46.99 v29.11,46.9 | v39.37,41.71 v39.37,39.37
  Bottom 1.778: v64.77,38.1 v72.39,38.1 | v46.99,20.32 49.53,20.32 49.53,19.05 64.77,19.05 64.77,27.94 v77.78,27.94
  pour Bottom: 43.18,60.96 43.18,0 80.01,0 80.01,60.96 78.74,60.96
GNDA  (via drill 0.35)
  Top 0.305: R6.1 12.83,34.39 12.83,35.53 13.06,35.76 13.06,37.82 12.83,38.05 11.68,38.05 10.54,36.91 C10.1 10.31,36.91 8.25,36.91 5.28,39.88 5.28,41.48 5.51,41.71 7.34,41.71 9.4,39.65 11.68,39.65 12.6,40.56 R5.1 12.83,40.79 13.97,40.79 | 13.97,40.79 18.09,40.79 18.54,40.33 18.54,38.51 18.09,38.05 17.4,38.05 | 17.4,38.05 17.4,37.59 IC5.5 | 17.4,38.05 IC5.4 | C11.1 10.31,30.28 10.31,27.99 R7.1 10.31,27.76 10.31,26.85 | IC1.5 16.03,14.96 13.97,14.96 12.83,16.1 C28.1 12.83,16.33 12.83,19.3 C26.1 12.6,19.53 10.31,21.82 | 10.31,21.82 10.31,26.85 | 13.97,40.79 13.97,27.53 13.28,26.85 10.31,26.85 | 12.6,45.36 v12.6,45.82 12.6,46.97 R2.2 | 12.6,45.36 10.54,43.31 C9.1 | 12.6,45.36 14.88,45.36 19.46,40.79 19.46,40.33 21.06,38.73 23.11,38.73 IC5.12 | 39.8,3.99 39.8,5.82 v41.63,7.64 43.23,9.25 48.03,9.25 | 48.03,9.25 49.4,7.87 C24.- | 39.8,3.99 R15.1 | 48.03,9.25 48.03,10.16 49.26,11.98 C22.1 | C2.2 21.51,33.02 22.88,31.65 22.88,29.36 LED1.C 23.11,29.13 23.11,27.08 24.26,25.93 24.26,24.79 29.97,19.07 30.43,19.07 JP2.4 30.66,19.07 32.03,20.45 36.6,20.45 37.06,19.99 37.06,14.96 35.92,13.82 35.92,11.53 C27.1 | 10.31,21.82 3.23,14.73 S1.A1 | 49.53,3.81 52.31,3.81 IC6.1 52.07,4.47 52.07,2.54 v55.88,2.54 | v64.77,3.81 R16.2 | JP6.1 39.62,3.81 39.8,3.99
  Top 0.61: C24.- 49.49,3.81 | 49.49,3.81 49.53,3.81 | 49.49,3.81 C25.1 | C23.- 49.49,12.7 C22.1
  Bottom 0.305: v55.88,2.54 64.77,2.54 v64.77,3.81
  pour Bottom: 0,60.96 41.91,60.96 41.91,0 39.37,0 0,0
IN_U  (via drill 0.35)
  Top 0.305: v21.51,14.96 21.51,11.07 IC1.14 | v38.43,44.22 38.43,45.82 37.97,46.28 IC2.1
  Bottom 0.305: v21.51,14.96 21.51,27.31 v38.43,44.22
IN_V  (via drill 0.35)
  Top 0.305: v40.03,20.68 40.03,11.3 38.2,9.47 23.11,9.47 22.43,10.16 22.43,10.85 IC1.15 | v41.4,21.36 41.4,21.82 41.86,22.28 41.86,32.11 37.97,35.99 IC3.1
  Bottom 0.305: v40.03,20.68 40.72,20.68 v41.4,21.36
IN_W
  Top 0.305: IC1.16 23.34,10.85 28.6,10.85 29.52,9.93 37.97,9.93 38.89,10.85 38.89,22.5 38.2,23.19 38.2,25.71 37.97,25.93 IC4.1
INT_U
  Top 0.305: IC1.1 16.26,18.16 16.26,33.02 16.71,33.48 16.71,34.62 15.24,35.56 14.53,36.27 14.53,38.73 15.16,39.37 15.24,39.37 15.92,40.05 IC5.1
INT_V  (via drill 0.35)
  Top 0.305: v17.4,18.16 17.4,17.7 16.94,17.25 16.26,17.25 IC1.2 | v24.71,38.05 24.71,39.42 24.03,40.11 23.34,40.11 IC5.14
  Bottom 0.305: v17.4,18.16 17.4,30.73 v24.71,38.05
INT_W  (via drill 0.35)
  Top 0.305: v16.03,33.93 14.88,32.79 14.88,16.79 15.11,16.56 16.03,16.56 IC1.3 | v21.51,39.42 23.11,39.42 IC5.13
  Bottom 0.305: v21.51,39.42 v16.03,33.93
N$1
  Top 0.305: D2.C 27.69,33.02 28.6,33.02 30.43,34.85 32.03,34.85 33.17,35.99 IC3.8 33.4,36.22 34.77,36.22 35.69,37.14 35.69,40.33 36.37,41.02 36.37,43.08 C5.2
N$2  (via drill 0.35)
  Top 0.305: v35,37.59 33.4,37.59 IC3.7
  Top 0.406: Q3.1 60.96,35.31 v60.96,33.02
  Bottom 0.305: v35,37.59 36.37,37.59 40.95,33.02
  Bottom 0.406: v60.96,33.02 40.95,33.02 v39.37,33.02
N$3
  Top 0.305: LED1.A 25.17,29.13 25.17,25.48 R12.2
N$4  (via drill 0.35)
  Top 0.305: v37.52,23.19 35.69,21.36 30.66,21.36 27.91,24.11 27.91,27.08 28.14,27.31 33.17,27.31 IC4.7
  Top 0.406: Q5.1 61.89,22.86 v60.96,22.86
  Bottom 0.305: v37.52,23.19 39.34,23.19 40.26,24.11 42.09,24.11 42.32,23.88 42.32,22.96 42.32,22.86
  Bottom 0.406: v60.96,22.86 42.32,22.86 v40.64,22.86
N$5
  Top 0.305: D3.C 31.57,22.96 31.57,24.33 33.17,25.93 IC4.8 33.4,25.93 35.23,25.93 35.46,26.16 35.46,29.82 36.37,30.73 C6.2
N$6  (via drill 0.35)
  Top 0.406: Q4.1 v48.26,36.83 | v40.64,36.83 40.64,40.64 38.1,40.64 IC3.4
  Bottom 0.406: v48.26,36.83 v40.64,36.83
N$7  (via drill 0.35)
  Top 0.406: Q1.1 v59.69,46.99 | v40.64,46.99 40.64,52.07 35.56,52.07 35.56,48.26 34.46,48.26 34.46,48.18 34.29,48.18 34.29,47.62 IC2.7
  Bottom 0.406: v59.69,46.99 v40.64,46.99
N$8  (via drill 0.35)
  Top 0.406: Q2.1 v48.26,43.18 | v39.37,43.18 39.37,50.8 38.1,50.8 IC2.4
  Bottom 0.406: v48.26,43.18 v39.37,43.18
N$9
  Top 0.305: IC7.1 59.69,10.58 59.69,8.89 60.96,8.89 R11.1 R16.1
N$10  (via drill 0.35)
  Top 0.406: Q6.1 v46.99,25.4 | v40.64,25.4 40.64,30.48 38.1,30.48 IC4.4
  Bottom 0.406: v46.99,25.4 v40.64,25.4
N$11
  Top 0.305: 31.12,46.05 31.34,46.28 33.17,46.28 IC2.8 | 31.12,46.05 30.2,45.14 29.06,45.14 27.69,43.76 27.69,43.31 D1.C | 31.12,46.05 31.12,51.08 29.97,52.22 29.97,53.82 30.66,54.51 35.23,54.51 36.37,53.36 C1.2
N$14
  Top 0.305: R12.1 22.88,25.25 22.88,23.19 19.91,20.22 19.91,19.53 IC1.29
N$18
  Top 0.305: IC1.9 17.4,10.85 12.14,10.85 11.45,10.16 JP3.1
N$26
  Top 0.305: IC1.6 16.03,14.05 12.83,14.05 C28.2 12.6,14.28 11.23,15.65 7.11,15.65 S1.B
N$31
  Top 0.305: IC1.30 19.23,19.53 19.23,24.11 JP4.1
SD_U
  Top 0.305: IC1.11 19.23,10.85 19.23,10.16 22.2,7.19 37.97,7.19 42.32,11.53 42.32,20.45 42.77,20.9 42.77,39.42 39.8,42.39 39.12,42.39 37.74,43.76 37.74,44.68 36.6,45.82 36.6,46.74 37.29,47.42 37.74,47.42 IC2.2
SD_V
  Top 0.305: IC1.12 19.91,10.85 19.91,10.16 22.43,7.64 37.74,7.64 41.63,11.53 41.63,20.45 42.32,21.13 42.32,33.48 38.43,37.36 37.97,37.36 IC3.2
SD_W
  Top 0.305: IC1.13 20.83,10.85 20.83,10.16 21.97,9.02 38.43,9.02 40.72,11.3 40.72,21.82 41.4,22.5 41.4,23.65 39.12,25.93 39.12,26.62 38.43,27.31 37.97,27.31 IC4.2
SYS_SWCLK
  Top 0.305: R14.1 35.69,15.42 35.69,17.25 36.6,18.16 36.6,19.76 36.37,19.99 34.09,19.99 30.66,16.56 JP2.3 30.43,16.56 27.69,19.3 23.34,19.3 IC1.25
SYS_SWDIO
  Top 0.305: R13.1 35.46,18.85 30.66,14.05 JP2.2 30.43,14.05 26.54,17.93 24.71,17.93 IC1.24
U  (via drill 0.35)
  Top 0.305: 55.35,43.18 55.35,43.31 Q2.4 | IC2.6 33.4,49.02 33.86,49.02 34.54,49.71 34.54,53.14 C1.1 34.54,53.36 v30.66,53.36 | R8.2 6.43,40.56 7.8,40.56 9.86,38.51 13.06,38.51 13.51,38.05 13.51,33.48 12.6,32.56 3,32.56 2.08,33.48 2.08,50.39 3.68,51.99 20.14,51.99 21.28,50.85 R1.2 21.51,50.85 23.8,53.14 v28.83,53.14
  Top 1.524: JP1.1 57.15,53.34 57.15,43.18
  Top 1.778: 57.15,43.18 55.88,43.18 Q2.4 | 55.35,43.18 Q2.4 | Q2.4 58.13,40.89 Q1.3
  Bottom 0.305: v28.83,53.14 30.43,53.14 v30.66,53.36 32.94,55.65 52.6,55.65 54.43,53.82 54.43,53.36 JP1.1
V  (via drill 0.35)
  Top 0.305: IC3.6 33.4,38.73 33.63,38.73 34.54,39.65 34.54,43.08 C5.1 34.54,43.31 32.26,43.31 31.34,44.22 29.29,44.22 v28.6,43.54 | v8.94,33.71 8.48,33.25 5.51,33.25 4.6,34.16 3.91,34.16 R9.2 | v19.91,44.68 19.91,45.59 21.28,46.97 R3.2
  Top 1.524: JP1.2 52.07,48.26 46.99,48.26 | 46.38,47.65 46.38,33.02 Q4.4
  Top 1.778: 46.99,48.26 46.38,47.65 | Q4.4 58.13,30.73 Q3.3
  Bottom 0.305: v8.94,33.71 17.52,44.45 19.69,44.45 v19.91,44.68 27.46,44.68 v28.6,43.54 30.89,43.54 38.43,51.08 51,51.08 51.92,51.99 51.92,53.14 JP1.2
W  (via drill 0.35)
  Top 0.305: v24.26,42.39 23.57,43.08 21.51,43.08 R4.2 | v25.63,41.02 25.63,40.56 26.77,39.42 26.77,31.88 | 26.77,31.88 26.77,30.05 28.37,28.45 33.17,28.45 IC4.6 | 26.77,31.88 28.14,31.88 30.43,34.16 31.34,34.16 32.49,33.02 34.54,33.02 C6.1 | R10.2 3.68,27.76 3.68,16.56 2.08,14.96 2.08,14.28 9.63,6.73 38.2,6.73 42.77,11.3 42.77,20.22 44.15,21.59 44.15,22.28 44.45,22.86 | v40.26,44.91 43.92,44.91 44.45,44.91
  Top 1.524: JP1.3 44.45,53.34 44.45,44.91 44.45,22.86 Q6.4
  Top 1.778: Q6.4 58.13,20.57 Q5.3
  Bottom 0.305: v24.26,42.39 v25.63,41.02 34.09,41.02 37.97,44.91 v40.26,44.91